# Altium schematic sheet BOTTOM_HEADER_WRP.SchDoc
size A
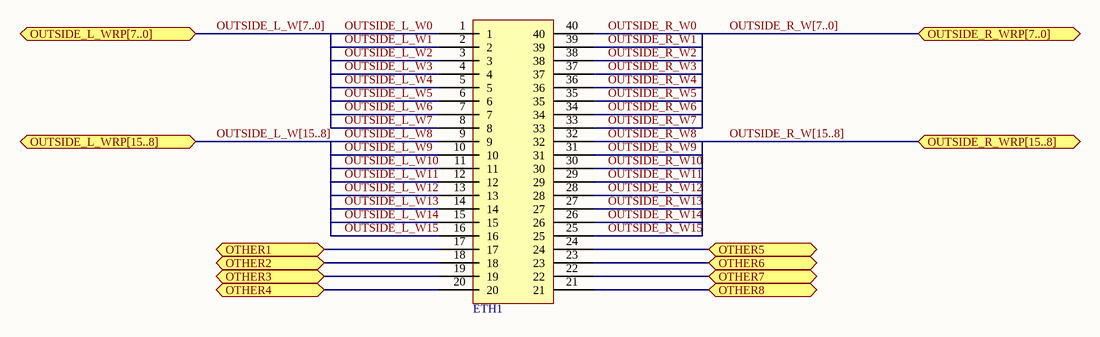
[diagram p0: BOTTOM_HEADER_WRP.SchDoc]

## Parts
ETH1  ADAFRUIT_HEADER  [FEMALE_HEADER_SMD]  (value not drawn)

## Ports
OTHER1, OTHER2, OTHER3, OTHER4, OTHER5, OTHER6, OTHER7, OTHER8, OUTSIDE_L_WRP[7..0], OUTSIDE_L_WRP[15..8], OUTSIDE_R_WRP[7..0], OUTSIDE_R_WRP[15..8]

## Nets
OTHER1: ETH1.17 ; port OTHER1
OTHER2: ETH1.18 ; port OTHER2
OTHER3: ETH1.19 ; port OTHER3
OTHER4: ETH1.20 ; port OTHER4
OTHER5: ETH1.24 ; port OTHER5
OTHER6: ETH1.23 ; port OTHER6
OTHER7: ETH1.22 ; port OTHER7
OTHER8: ETH1.21 ; port OTHER8
OUTSIDE_L_W0: ETH1.1
OUTSIDE_L_W1: ETH1.2
OUTSIDE_L_W2: ETH1.3
OUTSIDE_L_W3: ETH1.4
OUTSIDE_L_W4: ETH1.5
OUTSIDE_L_W5: ETH1.6
OUTSIDE_L_W6: ETH1.7
OUTSIDE_L_W7: ETH1.8
OUTSIDE_L_W8: ETH1.9
OUTSIDE_L_W9: ETH1.10
OUTSIDE_L_W10: ETH1.11
OUTSIDE_L_W11: ETH1.12
OUTSIDE_L_W12: ETH1.13
OUTSIDE_L_W13: ETH1.14
OUTSIDE_L_W14: ETH1.15
OUTSIDE_L_W15: ETH1.16
OUTSIDE_R_W0: ETH1.40
OUTSIDE_R_W1: ETH1.39
OUTSIDE_R_W2: ETH1.38
OUTSIDE_R_W3: ETH1.37
OUTSIDE_R_W4: ETH1.36
OUTSIDE_R_W5: ETH1.35
OUTSIDE_R_W6: ETH1.34
OUTSIDE_R_W7: ETH1.33
OUTSIDE_R_W8: ETH1.32
OUTSIDE_R_W9: ETH1.31
OUTSIDE_R_W10: ETH1.30
OUTSIDE_R_W11: ETH1.29
OUTSIDE_R_W12: ETH1.28
OUTSIDE_R_W13: ETH1.27
OUTSIDE_R_W14: ETH1.26
OUTSIDE_R_W15: ETH1.25

## Buses and harness runs
bus OUTSIDE_L_W[7..0] = port OUTSIDE_L_WRP[7..0]
bus OUTSIDE_L_W[15..8] = port OUTSIDE_L_WRP[15..8]
bus OUTSIDE_R_W[7..0] = port OUTSIDE_R_WRP[7..0]
bus OUTSIDE_R_W[15..8] = port OUTSIDE_R_WRP[15..8]

## Library data of the parts
ETH1 = ADAFRUIT_HEADER: Extra tall female header (SMD)